# Altium project DGAS.PrjPcb
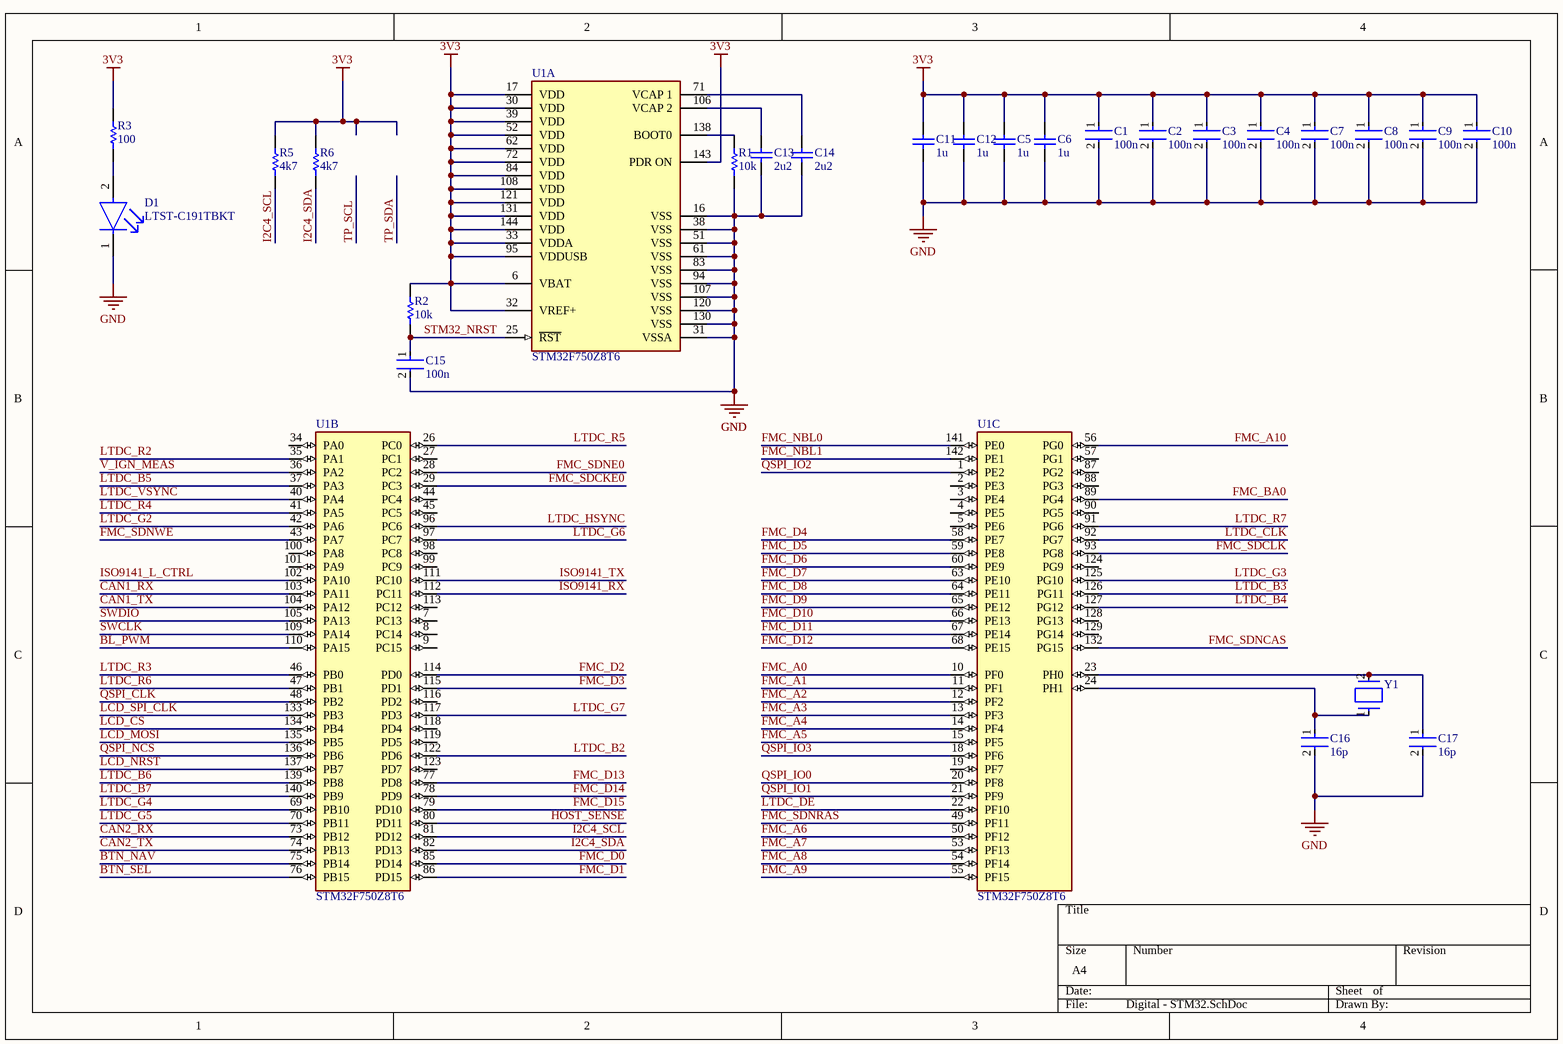
[diagram p0: Digital - STM32.SchDoc]
7 sheets, 89 parts. Net scope: global (net labels, ports and power ports of the same name join across sheets).
Board file: PCB1.PcbDoc
Sheets:
  Digital - STM32.SchDoc
  LCD.SchDoc
  DRAM and QSPI.SchDoc
  Audio.SchDoc
  OBD2.SchDoc
  Accelerometer.SchDoc
  Misc.SchDoc

## Sheet Digital - STM32.SchDoc
size A4; SheetNumber: 1; SheetTotal: 8

### Parts
C1  100n  [FP-GRM188-0_1-e0_2_0_55-IPC_A]
C2  100n  [FP-GRM188-0_1-e0_2_0_55-IPC_A]
C3  100n  [FP-GRM188-0_1-e0_2_0_55-IPC_A]
C4  100n  [FP-GRM188-0_1-e0_2_0_55-IPC_A]
C5  1u  [CAPC2013X135X45LL10T25]
C6  1u  [CAPC2013X135X45LL10T25]
C7  100n  [FP-GRM188-0_1-e0_2_0_55-IPC_A]
C8  100n  [FP-GRM188-0_1-e0_2_0_55-IPC_A]
C9  100n  [FP-GRM188-0_1-e0_2_0_55-IPC_A]
C10  100n  [FP-GRM188-0_1-e0_2_0_55-IPC_A]
C11  1u  [CAPC2013X135X45LL10T25]
C12  1u  [CAPC2013X135X45LL10T25]
C13  2u2  [CAPC2013X135X45LL10T25]
C14  2u2  [CAPC2013X135X45LL10T25]
C15  100n  [FP-GRM188-0_1-e0_2_0_55-IPC_A]
C16  16p  [FP-GRM188-0_1-e0_2_0_55-IPC_A]
C17  16p  [FP-GRM188-0_1-e0_2_0_55-IPC_A]
D1  LTST-C191TBKT  [FP-LTST-C191TBKT-MFG]
R1  10k  [RESC1608X55X30ML15T15]
R2  10k  [RESC1608X55X30ML15T15]
R3  100  [RESC1608X55X30ML15T15]
R5  4k7  [RESC1608X55X30ML15T15]
R6  4k7  [RESC1608X55X30ML15T15]
U1  STM32F750Z8T6  [FP-LQFP144-1A-MFG]  (parts A,B,C of 3)
Y1  ABM7-16.000MHZ-D2Y-T  [FP-ABM7-MFG]  (value not drawn)

### Nets
3V3: C1.1 C2.1 C3.1 C4.1 C5.2 C6.2 C7.1 C8.1 C9.1 C10.1 C11.2 C12.2 R2.2 R3.2 R5.2 R6.2 U1.6(VBAT) U1.17(VDD) U1.30(VDD) U1.32(VREF+) U1.33(VDDA) U1.39(VDD) U1.52(VDD) U1.62(VDD) U1.72(VDD) U1.84(VDD) U1.95(VDDUSB) U1.108(VDD) U1.121(VDD) U1.131(VDD) U1.143(PDR_ON) U1.144(VDD)
GND: C1.2 C2.2 C3.2 C4.2 C5.1 C6.1 C7.2 C8.2 C9.2 C10.2 C11.1 C12.1 C13.1 C14.1 C15.2 C16.2 C17.2 D1.1(C) R1.1 U1.16(VSS) U1.31(VSSA) U1.38(VSS) U1.51(VSS) U1.61(VSS) U1.83(VSS) U1.94(VSS) U1.107(VSS) U1.120(VSS) U1.130(VSS)
BL_PWM: U1.110(PA15)
BTN_NAV: U1.75(PB14)
BTN_SEL: U1.76(PB15)
CAN1_RX: U1.103(PA11)
CAN1_TX: U1.104(PA12)
CAN2_RX: U1.73(PB12)
CAN2_TX: U1.74(PB13)
FMC_A0: U1.10(PF0)
FMC_A1: U1.11(PF1)
FMC_A2: U1.12(PF2)
FMC_A3: U1.13(PF3)
FMC_A4: U1.14(PF4)
FMC_A5: U1.15(PF5)
FMC_A6: U1.50(PF12)
FMC_A7: U1.53(PF13)
FMC_A8: U1.54(PF14)
FMC_A9: U1.55(PF15)
FMC_A10: U1.56(PG0)
FMC_BA0: U1.89(PG4)
FMC_D0: U1.85(PD14)
FMC_D1: U1.86(PD15)
FMC_D2: U1.114(PD0)
FMC_D3: U1.115(PD1)
FMC_D4: U1.58(PE7)
FMC_D5: U1.59(PE8)
FMC_D6: U1.60(PE9)
FMC_D7: U1.63(PE10)
FMC_D8: U1.64(PE11)
FMC_D9: U1.65(PE12)
FMC_D10: U1.66(PE13)
FMC_D11: U1.67(PE14)
FMC_D12: U1.68(PE15)
FMC_D13: U1.77(PD8)
FMC_D14: U1.78(PD9)
FMC_D15: U1.79(PD10)
FMC_NBL0: U1.141(PE0)
FMC_NBL1: U1.142(PE1)
FMC_SDCKE0: U1.29(PC3)
FMC_SDCLK: U1.93(PG8)
FMC_SDNCAS: U1.132(PG15)
FMC_SDNE0: U1.28(PC2)
FMC_SDNRAS: U1.49(PF11)
FMC_SDNWE: U1.43(PA7)
HOST_SENSE: U1.80(PD11)
I2C4_SCL: R5.1 U1.81(PD12)
I2C4_SDA: R6.1 U1.82(PD13)
ISO9141_L_CTRL: U1.102(PA10)
ISO9141_RX: U1.112(PC11)
ISO9141_TX: U1.111(PC10)
LCD_CS: U1.134(PB4)
LCD_MOSI: U1.135(PB5)
LCD_NRST: U1.137(PB7)
LCD_SPI_CLK: U1.133(PB3)
LTDC_B2: U1.122(PD6)
LTDC_B3: U1.126(PG11)
LTDC_B4: U1.127(PG12)
LTDC_B5: U1.37(PA3)
LTDC_B6: U1.139(PB8)
LTDC_B7: U1.140(PB9)
LTDC_CLK: U1.92(PG7)
LTDC_DE: U1.22(PF10)
LTDC_G2: U1.42(PA6)
LTDC_G3: U1.125(PG10)
LTDC_G4: U1.69(PB10)
LTDC_G5: U1.70(PB11)
LTDC_G6: U1.97(PC7)
LTDC_G7: U1.117(PD3)
LTDC_HSYNC: U1.96(PC6)
LTDC_R2: U1.35(PA1)
LTDC_R3: U1.46(PB0)
LTDC_R4: U1.41(PA5)
LTDC_R5: U1.26(PC0)
LTDC_R6: U1.47(PB1)
LTDC_R7: U1.91(PG6)
LTDC_VSYNC: U1.40(PA4)
QSPI_CLK: U1.48(PB2)
QSPI_IO0: U1.20(PF8)
QSPI_IO1: U1.21(PF9)
QSPI_IO2: U1.1(PE2)
QSPI_IO3: U1.18(PF6)
QSPI_NCS: U1.136(PB6)
STM32_NRST: C15.1 R2.1 U1.25(~{RST})
SWCLK: U1.109(PA14)
SWDIO: U1.105(PA13)
V_IGN_MEAS: U1.36(PA2)
NetC13_2: C13.2 U1.106(VCAP_2)
NetC14_2: C14.2 U1.71(VCAP_1)
NetC16_1: C16.1 U1.24(PH1) Y1.1
NetC17_1: C17.1 U1.23(PH0) Y1.2
NetD1_2: D1.2(A) R3.1
NetR1_2: R1.2 U1.138(BOOT0)

Not connected (* = marked no-connect by the designer): U1 2(PE3) 3(PE4) 4(PE5) 5(PE6) 7(PC13) 8(PC14) 9(PC15) 19(PF7) 27(PC1) 34(PA0) 44(PC4) 45(PC5) 57(PG1) 87(PG2) 88(PG3) 90(PG5) 98(PC8) 99(PC9) 100(PA8) 101(PA9) 113(PC12) 116(PD2) 118(PD4) 119(PD5) 123(PD7) 124(PG9) 128(PG13) 129(PG14)

### Library data of the parts
C1-C4 C7-C10 C15-C17 = CMP-2006-02792-2: Chip Multilayer Ceramic Capacitors for General Purpose, 0603, 10uF, X5R, 15%, 20%, 6.3V; Packaging: Tape and Reel; Voltage Rating (DC): 6.3V; Width: 0.031inch; Termination: SMD/SMT; Dielectric: X5R; Package Quantity: 4000; Voltage Rating: 6.3V; Capacitance: 10uF; Case/Package: 0603; Min Operating Temperature: -55°C; Voltage: 6.3V; Length: 1.6mm; Thickness: 0.035inch; Lead Free: Lead Free; Depth: 0.8mm; Case Code (Imperial): 0603; Max Operating Temperature: 85°C; Material: Ceramic; Height: 0.8mm; Tolerance: 20%; Mount: Surface Mount; REACH SVHC: No SVHC; Radiation Hardening: No; Case Code (Metric): 1608
C5 C6 C11-C14 = CMP-1662-00015-2: Chip Capacitor, 4.7 uF, +/- 10%, 16 V, -55 to 85 degC, 0805 (2012 Metric), RoHS, Tape and Reel; PartNumber: GRM21BR61C475KA88L; Voltage Rating (DC): 16 V; Capacitance: 4.7 uF; Type (Capacitors): X5R; Case\/Package: 0805; Pins: 2; DatasheetVersion: 03/2016; REACH SVHC: No SVHC; Tolerance: 10%; Width: 1.25 mm; Mount: Surface Mount; ComponentLink1Description: Manufacturer URL; Case Code (Metric): 2012; PackageDescription: 2-Pin Surface Mount Device, Body 2 x 1.25 mm; Height: 1.25 mm; Voltage Rating: 16 V; Max Operating Temperature: 85 degC; RoHSCompliant: true; Length: 2 mm; ComponentLink1URL: http://www.murata.com/; Mounting Technology: Surface Mount; Packaging: Tape and Reel; Min Operating Temperature: -55 degC; ComponentLink2Description: Datasheet; Case Code (Imperial): 0805; Radiation Hardening: No; Package Quantity: 3000; PackageReference: 0805; ComponentLink2URL: http://search.murata.co.jp/Ceramy/image/img/A01X/G101/ENG/GRM21BR61C475KA88-01.pdf
D1 = CMP-22017-000008-1: LED BLUE CLEAR CHIP SMD; Lens Color: Colorless; Dominant Wavelength: 475nm; Forward Current: 20mA; Wavelength: 468nm; Viewing Angle: 130°; Power Dissipation: 76mW; Luminous Intensity: 180mcd; Reverse Voltage: 5V; Number of Elements: 1; Lens Style: Diffused; Forward Voltage: 3.8V; Max Power Dissipation: 75mW; Case Code (Metric): 1608; Packaging: Tape and Reel; Case/Package: 0603; Depth: 1.6mm; Mount: Surface Mount; Lead Free: Lead Free; Min Operating Temperature: -20°C; Lens Transparency: Clear; Illumination Color: Blue; Height: 0.55mm; Test Current: 20mA; Case Code (Imperial): 0603; Max Operating Temperature: 80°C; Number of Pins: 2; Length: 0.8mm; Radiation Hardening: No; Package Quantity: 1; Number of LEDs: 1; Width: 0.8mm; Color: Blue
R1-R3 R5 R6 = CMP-2000-00182-1: Part Number: ERJ-3EKF1003V; Manufacturer: Panasonic
U1 = CMP-12105-000056-1: IC MCU 32BIT 64KB FLASH 144LQFP; Manufacturer: STMicroelectronics; Number Of Cores: 1; Number Of Adc Channels: 24; Number Of Timers/Counters: 15; Number Of A/D Converters: 3; Interface: I2C,SPI,UART,USART,CAN,USB,LIN,IrDA,Ethernet,I2S,Other; Standoff Height: 0.05mm; Ram Size: 320KBytes; Max Supply Voltage: 3.6V; Number Of I2C Channels: 4; Min Supply Voltage: 1.7V; Nominal Supply Current: 12-216mA; Max Junction Temp: +105°C; Data Bus Width: 32bits; Number Of Spi Channels: 6; Core Architecture: ARM Cortex-M7; Number Of Uart Channels: 8; Memory Size: 64KBytes; Frequency: 216MHz; Number Of Pwm Channels: 33; Number Of I/Os: 114; RoHS: TRUE; Temperature Range Low: -40°C; Mouser Description: MCU 32-Bit STM32F750Z8 ARM Cortex M7 RISC 64KB Flash 1.8V/2.5V/3.3V 144-Pin LQFP Tray; Height: 1.6mm; Temperature: -40°C to +105°C; Number Of Usb Channels: 1; Package: LQFP144-1A; Ipc Land Pattern Name: QFP50P2200X2200X160-144; Number Of Ethernet Channels: 1; Automotive: No; Memory Type: FLASH; Digikey Description: IC MCU 32BIT 64KB FLASH 144LQFP; Category: IC; ComponentLink2Description: Datasheet; Device Class L1: Integrated Circuits (ICs); Ambient Temperature Range High: +85°C; Device Class L2: Embedded Processors and Controllers; Device Class L3: Microcontrollers; Temperature Range High: +105°C; Octopart: https://octopart.com/stm32f750z8t6-stmicroelectronics-94048545; Manufacturer Part Number: STM32F750Z8T6; ComponentLink2URL: https://www.st.com/resource/en/datasheet/stm32f750z8.pdf; Ambient Temperature Range Low: -40°C; Lead Free: Yes
Y1 = CMP-27762-000095-1: Crystal 16MHz ±20ppm 18pF SMD-2 6mm x 3.5mm; ESR (Equivalent Series Resistance): 50R; Frequency Stability: 30ppm; Width: 3.3mm; Frequency: 16MHz; Radiation Hardening: No; Height: 0.055inch; Tolerance: 20ppm; Length: 6mm; Case/Package: CSMD; Lead Free: Lead Free; Min Operating Temperature: -40°C; Termination: SMD/SMT; Operating Frequency: 16 MHz; Resistor Type: Ceramic; Packaging: Tape and Reel; Mount: Surface Mount; Load Capacitance: 18pF; Frequency Tolerance: 20ppm; Depth: 3.5mm; Series: ABM7; Package Quantity: 1000; Max Operating Temperature: 85°C; Number of Pins: 2

## Sheet LCD.SchDoc
size A4; SheetNumber: 2; SheetTotal: 8
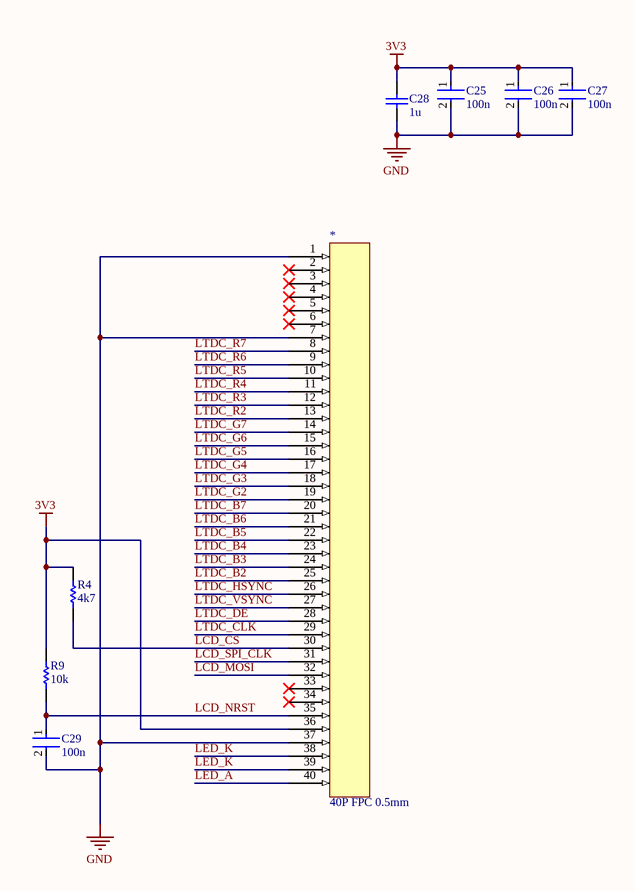
[diagram p1: LCD.SchDoc]

### Parts
*  40P FPC 0.5mm  [CONN_62684-402100ALF_AMP]
C25  100n  [FP-GRM188-0_1-e0_2_0_55-IPC_A]
C26  100n  [FP-GRM188-0_1-e0_2_0_55-IPC_A]
C27  100n  [FP-GRM188-0_1-e0_2_0_55-IPC_A]
C28  1u  [CAPC2013X135X45LL10T25]
C29  100n  [FP-GRM188-0_1-e0_2_0_55-IPC_A]
R4  4k7  [RESC1608X55X30ML15T15]
R9  10k  [RESC1608X55X30ML15T15]

### Nets
3V3: *.36 C25.1 C26.1 C27.1 C28.2 R4.2 R9.2
GND: *.1 *.7 *.37 C25.2 C26.2 C27.2 C28.1 C29.2
LCD_CS: *.30 R4.1
LCD_MOSI: *.32
LCD_NRST: *.35 C29.1 R9.1
LCD_SPI_CLK: *.31
LED_A: *.40
LED_K: *.38 *.39
LTDC_B2: *.25
LTDC_B3: *.24
LTDC_B4: *.23
LTDC_B5: *.22
LTDC_B6: *.21
LTDC_B7: *.20
LTDC_CLK: *.29
LTDC_DE: *.28
LTDC_G2: *.19
LTDC_G3: *.18
LTDC_G4: *.17
LTDC_G5: *.16
LTDC_G6: *.15
LTDC_G7: *.14
LTDC_HSYNC: *.26
LTDC_R2: *.13
LTDC_R3: *.12
LTDC_R4: *.11
LTDC_R5: *.10
LTDC_R6: *.9
LTDC_R7: *.8
LTDC_VSYNC: *.27

Not connected (* = marked no-connect by the designer): * 2* 3* 4* 5* 6* 33* 34*

### Library data of the parts
C25-C27 C29 = CMP-2006-02792-2: as C1 on sheet Digital - STM32; Packaging: Tape and Reel; Voltage Rating (DC): 6.3V; Width: 0.031inch; Termination: SMD/SMT; Dielectric: X5R; Package Quantity: 4000; Voltage Rating: 6.3V; Capacitance: 10uF; Case/Package: 0603; Min Operating Temperature: -55°C; Voltage: 6.3V; Length: 1.6mm; Thickness: 0.035inch; Lead Free: Lead Free; Depth: 0.8mm; Case Code (Imperial): 0603; Max Operating Temperature: 85°C; Material: Ceramic; Height: 0.8mm; Tolerance: 20%; Mount: Surface Mount; REACH SVHC: No SVHC; Radiation Hardening: No; Case Code (Metric): 1608
C28 = CMP-1662-00015-2: as C5 on sheet Digital - STM32; Pins: 2; DatasheetVersion: 03/2016; REACH SVHC: No SVHC; Tolerance: 10%; Width: 1.25 mm; Mount: Surface Mount; ComponentLink1Description: Manufacturer URL; Case Code (Metric): 2012; PackageDescription: 2-Pin Surface Mount Device, Body 2 x 1.25 mm; Height: 1.25 mm; Voltage Rating: 16 V; Max Operating Temperature: 85 degC; RoHSCompliant: true; Length: 2 mm; ComponentLink1URL: http://www.murata.com/; Mounting Technology: Surface Mount; Packaging: Tape and Reel; Min Operating Temperature: -55 degC; ComponentLink2Description: Datasheet; Case Code (Imperial): 0805; Radiation Hardening: No; Package Quantity: 3000; PackageReference: 0805; ComponentLink2URL: http://search.murata.co.jp/Ceramy/image/img/A01X/G101/ENG/GRM21BR61C475KA88-01.pdf
R4 R9 = CMP-2000-00182-1: as R1 on sheet Digital - STM32

## Sheet DRAM and QSPI.SchDoc
size A4; SheetNumber: 3; SheetTotal: 8
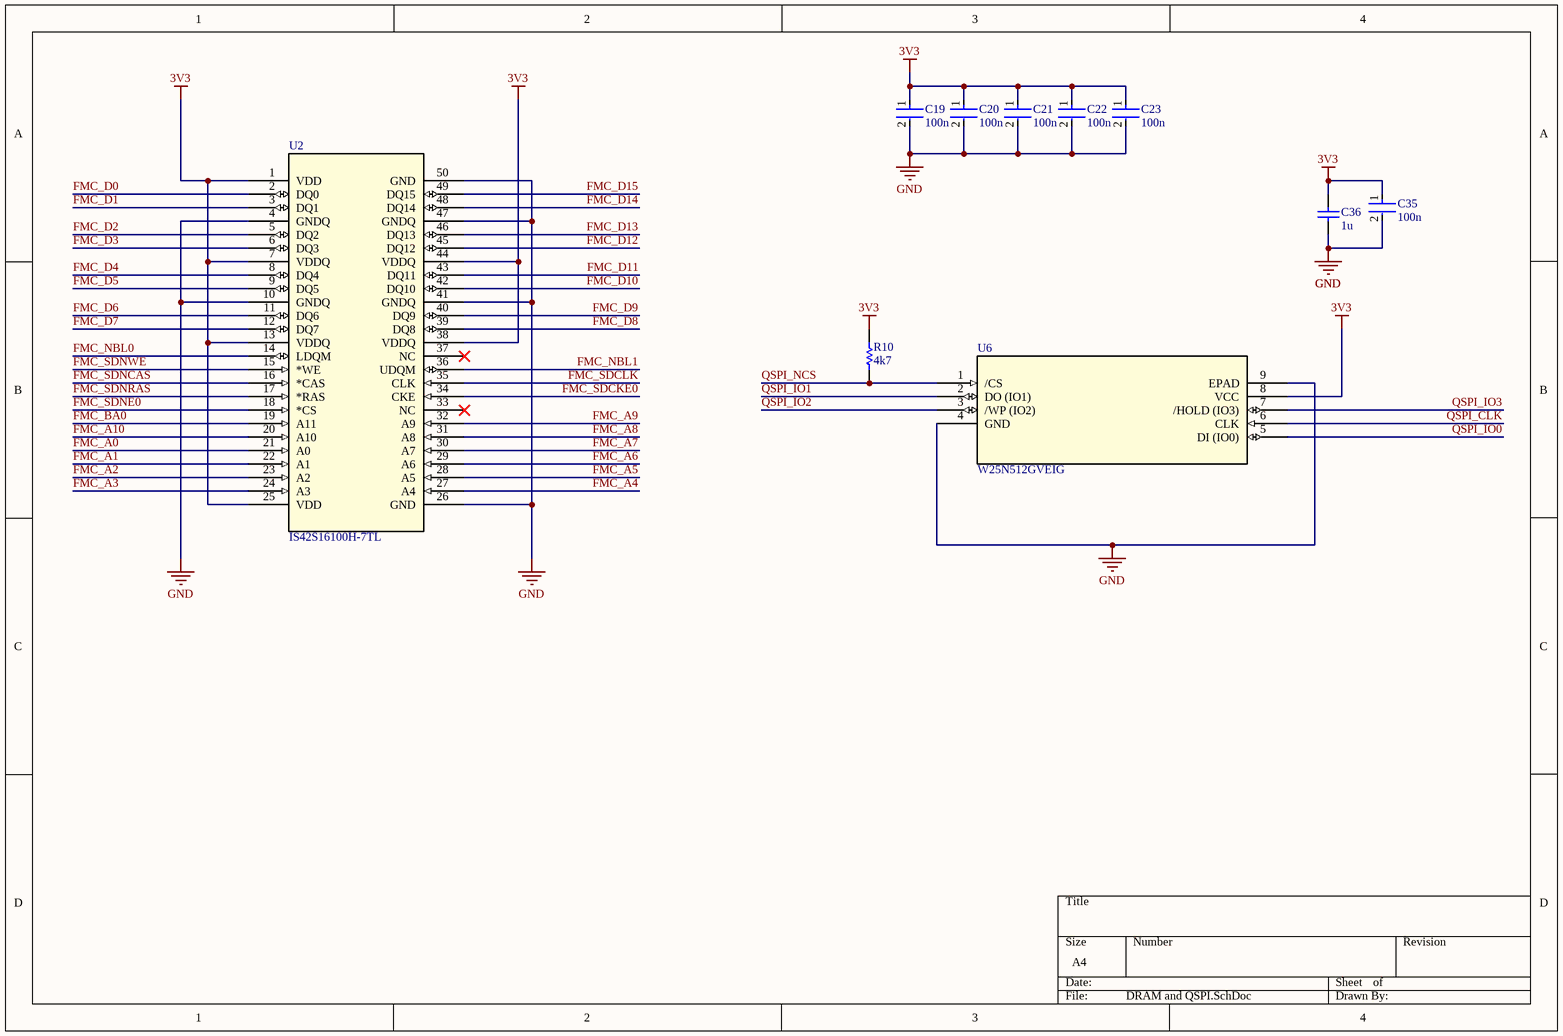
[diagram p2: DRAM and QSPI.SchDoc]

### Parts
C19  100n  [FP-GRM188-0_1-e0_2_0_55-IPC_A]
C20  100n  [FP-GRM188-0_1-e0_2_0_55-IPC_A]
C21  100n  [FP-GRM188-0_1-e0_2_0_55-IPC_A]
C22  100n  [FP-GRM188-0_1-e0_2_0_55-IPC_A]
C23  100n  [FP-GRM188-0_1-e0_2_0_55-IPC_A]
C35  100n  [FP-GRM188-0_1-e0_2_0_55-IPC_A]
C36  1u  [CAPC2013X135X45LL10T25]
R10  4k7  [RESC1608X55X30ML15T15]
U2  IS42S16100H-7TL  [TSOPII_50L_400MIL_ISI]
U6  W25N512GVEIG  [WSON8_8x6_E_WIN]

### Nets
3V3: C19.1 C20.1 C21.1 C22.1 C23.1 C35.1 C36.2 R10.2 U2.1(VDD) U2.7(VDDQ) U2.13(VDDQ) U2.25(VDD) U2.38(VDDQ) U2.44(VDDQ) U6.8(VCC)
GND: C19.2 C20.2 C21.2 C22.2 C23.2 C35.2 C36.1 U2.4(GNDQ) U2.10(GNDQ) U2.26(GND) U2.41(GNDQ) U2.47(GNDQ) U2.50(GND) U6.4(GND) U6.9(EPAD)
FMC_A0: U2.21(A0)
FMC_A1: U2.22(A1)
FMC_A2: U2.23(A2)
FMC_A3: U2.24(A3)
FMC_A4: U2.27(A4)
FMC_A5: U2.28(A5)
FMC_A6: U2.29(A6)
FMC_A7: U2.30(A7)
FMC_A8: U2.31(A8)
FMC_A9: U2.32(A9)
FMC_A10: U2.20(A10)
FMC_BA0: U2.19(A11)
FMC_D0: U2.2(DQ0)
FMC_D1: U2.3(DQ1)
FMC_D2: U2.5(DQ2)
FMC_D3: U2.6(DQ3)
FMC_D4: U2.8(DQ4)
FMC_D5: U2.9(DQ5)
FMC_D6: U2.11(DQ6)
FMC_D7: U2.12(DQ7)
FMC_D8: U2.39(DQ8)
FMC_D9: U2.40(DQ9)
FMC_D10: U2.42(DQ10)
FMC_D11: U2.43(DQ11)
FMC_D12: U2.45(DQ12)
FMC_D13: U2.46(DQ13)
FMC_D14: U2.48(DQ14)
FMC_D15: U2.49(DQ15)
FMC_NBL0: U2.14(LDQM)
FMC_NBL1: U2.36(UDQM)
FMC_SDCKE0: U2.34(CKE)
FMC_SDCLK: U2.35(CLK)
FMC_SDNCAS: U2.16(*CAS)
FMC_SDNE0: U2.18(*CS)
FMC_SDNRAS: U2.17(*RAS)
FMC_SDNWE: U2.15(*WE)
QSPI_CLK: U6.6(CLK)
QSPI_IO0: U6.5(DI_(IO0))
QSPI_IO1: U6.2(DO_(IO1))
QSPI_IO2: U6.3(/WP_(IO2))
QSPI_IO3: U6.7(/HOLD_(IO3))
QSPI_NCS: R10.1 U6.1(/CS)

Not connected (* = marked no-connect by the designer): U2 33(NC)* 37(NC)*

### Library data of the parts
C19-C23 C35 = CMP-2006-02792-2: as C1 on sheet Digital - STM32; Packaging: Tape and Reel; Voltage Rating (DC): 6.3V; Width: 0.031inch; Termination: SMD/SMT; Dielectric: X5R; Package Quantity: 4000; Voltage Rating: 6.3V; Capacitance: 10uF; Case/Package: 0603; Min Operating Temperature: -55°C; Voltage: 6.3V; Length: 1.6mm; Thickness: 0.035inch; Lead Free: Lead Free; Depth: 0.8mm; Case Code (Imperial): 0603; Max Operating Temperature: 85°C; Material: Ceramic; Height: 0.8mm; Tolerance: 20%; Mount: Surface Mount; REACH SVHC: No SVHC; Radiation Hardening: No; Case Code (Metric): 1608
C36 = CMP-1662-00015-2: as C5 on sheet Digital - STM32; Pins: 2; DatasheetVersion: 03/2016; REACH SVHC: No SVHC; Tolerance: 10%; Width: 1.25 mm; Mount: Surface Mount; ComponentLink1Description: Manufacturer URL; Case Code (Metric): 2012; PackageDescription: 2-Pin Surface Mount Device, Body 2 x 1.25 mm; Height: 1.25 mm; Voltage Rating: 16 V; Max Operating Temperature: 85 degC; RoHSCompliant: true; Length: 2 mm; ComponentLink1URL: http://www.murata.com/; Mounting Technology: Surface Mount; Packaging: Tape and Reel; Min Operating Temperature: -55 degC; ComponentLink2Description: Datasheet; Case Code (Imperial): 0805; Radiation Hardening: No; Package Quantity: 3000; PackageReference: 0805; ComponentLink2URL: http://search.murata.co.jp/Ceramy/image/img/A01X/G101/ENG/GRM21BR61C475KA88-01.pdf
R10 = CMP-2000-00182-1: as R1 on sheet Digital - STM32
U2 = IS42S16100H-7TL: No Description Available; Mfr_Name: ISSI; RefDes: RefDes; Type: Type
U6 = W25N512GVEIG: No Description Available; Mfr_Name: Winbond; Type: Memory; RefDes: RefDes

## Sheet Audio.SchDoc
size A4; SheetNumber: 5; SheetTotal: 7
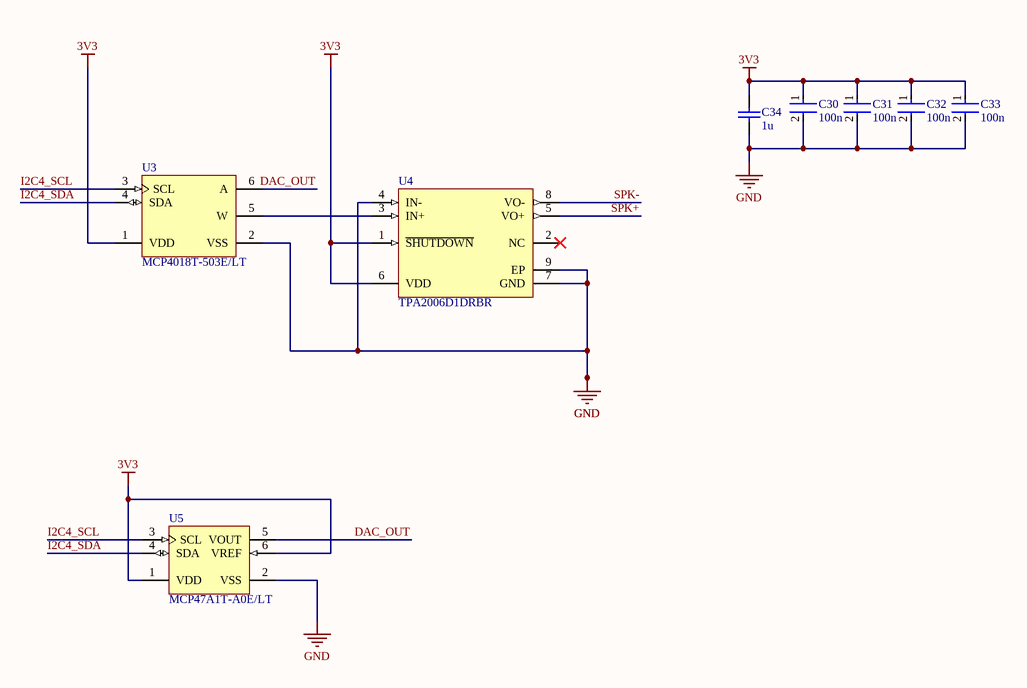
[diagram p3: Audio.SchDoc]

### Parts
C30  100n  [FP-GRM188-0_1-e0_2_0_55-IPC_A]
C31  100n  [FP-GRM188-0_1-e0_2_0_55-IPC_A]
C32  100n  [FP-GRM188-0_1-e0_2_0_55-IPC_A]
C33  100n  [FP-GRM188-0_1-e0_2_0_55-IPC_A]
C34  1u  [CAPC2013X135X45LL10T25]
U3  MCP4018T-503E/LT  [SC70-LT6_N]
U4  TPA2006D1DRBR  [DRB0008A_V]
U5  MCP47A1T-A0E/LT  [MCHP-SC70-LT6_N]

### Nets
3V3: C30.1 C31.1 C32.1 C33.1 C34.2 U3.1(VDD) U4.1(~{SHUTDOWN}) U4.6(VDD) U5.1(VDD) U5.6(VREF)
GND: C30.2 C31.2 C32.2 C33.2 C34.1 U3.2(VSS) U4.4(IN-) U4.7(GND) U4.9(EP) U5.2(VSS)
DAC_OUT: U3.6(A) U5.5(VOUT)
I2C4_SCL: U3.3(SCL) U5.3(SCL)
I2C4_SDA: U3.4(SDA) U5.4(SDA)
SPK+: U4.5(VO+)
SPK-: U4.8(VO-)
NetU3_5: U3.5(W) U4.3(IN+)

Not connected (* = marked no-connect by the designer): U4 2(NC)*

### Library data of the parts
C30-C33 = CMP-2006-02792-2: as C1 on sheet Digital - STM32; Packaging: Tape and Reel; Voltage Rating (DC): 6.3V; Width: 0.031inch; Termination: SMD/SMT; Dielectric: X5R; Package Quantity: 4000; Voltage Rating: 6.3V; Capacitance: 10uF; Case/Package: 0603; Min Operating Temperature: -55°C; Voltage: 6.3V; Length: 1.6mm; Thickness: 0.035inch; Lead Free: Lead Free; Depth: 0.8mm; Case Code (Imperial): 0603; Max Operating Temperature: 85°C; Material: Ceramic; Height: 0.8mm; Tolerance: 20%; Mount: Surface Mount; REACH SVHC: No SVHC; Radiation Hardening: No; Case Code (Metric): 1608
C34 = CMP-1662-00015-2: as C5 on sheet Digital - STM32; Pins: 2; DatasheetVersion: 03/2016; REACH SVHC: No SVHC; Tolerance: 10%; Width: 1.25 mm; Mount: Surface Mount; ComponentLink1Description: Manufacturer URL; Case Code (Metric): 2012; PackageDescription: 2-Pin Surface Mount Device, Body 2 x 1.25 mm; Height: 1.25 mm; Voltage Rating: 16 V; Max Operating Temperature: 85 degC; RoHSCompliant: true; Length: 2 mm; ComponentLink1URL: http://www.murata.com/; Mounting Technology: Surface Mount; Packaging: Tape and Reel; Min Operating Temperature: -55 degC; ComponentLink2Description: Datasheet; Case Code (Imperial): 0805; Radiation Hardening: No; Package Quantity: 3000; PackageReference: 0805; ComponentLink2URL: http://search.murata.co.jp/Ceramy/image/img/A01X/G101/ENG/GRM21BR61C475KA88-01.pdf
U3 = CMP-0188-00772-2: 7-Bit Single I2C Digital POT with Volatile Memory, 6-pin SC70, Extended Temperature, Tape and Reel; PackageReference: SC70-LT6; PackageVersion: revBB, Aug-2009; PackageDescription: 6-Lead Plastic Small Outline Transistor (LT) [SC70]; RevisionNote: URLs added.; DatasheetVersion: revA, Mar-2009; ComponentLink3Description: Package Specification; ComponentLink1Description: Manufacturer URL; ComponentLink2URL: http://ww1.microchip.com/downloads/en/DeviceDoc/22147a.pdf; ComponentLink1URL: http://www.microchip.com/; ComponentLink3URL: http://www.microchip.com/stellent/groups/techpub_sg/documents/packagingspec/en012702.pdf; ComponentLink2Description: Datasheet
U4 = CMP-0991-00129-2: 1.45-W Mono Class-D Audio Amplifier with 1.8 V Compatible Shutdown Voltage, -40 to 85 degC, 8-pin SON (DRB8), Green (RoHS & no Sb/Br); Manufacturer: Texas Instruments; Supply Min(Min)(Volt): 2.5; Supply Max(Max)(Volt): 5.5; PSRR(dB): -75; SubFamily: Dynamic Speaker; Output Power(W): 1.45; ComponentLink1Description: Manufacturer URL; ComponentLink3Description: Package Specification; Speaker Amp Type: Class-D; ComponentLink2Description: Datasheet; PartNumber: TPA2006D1DRBR; ComponentLink3URL: http://www.ti.com/litv/pdf/mpds118h; Mounting Technology: Surface Mount; PackageVersion: 4203482-2/K, 06/2012; PackageDescription: 8-Pin Plastic Small Outline, Body 3 x 3 mm, Pitch 0.65 mm; Eco-Plan: Green (RoHS & no Sb/Br); DatasheetVersion: SLOS498A; ComponentLink1URL: http://www.ti.com/; ComponentLink2URL: http://www.ti.com/general/docs/lit/getliterature.tsp?genericPartNumber=TPA2006D1&fileType=pdf; Speaker Channels: Mono; PackageReference: DRB0008A
U5 = CMP-0188-01388-1: 6-Bit Volatile DAC with Command Code, 130 µA Typical Operating Current, -40 to 125 degC, 6-pin SC70 (LT6), Tape and Reel; Manufacturer: Microchip; ComponentLink1URL: http://www.microchip.com; ComponentLink3Description: Package Specification; ComponentLink2URL: http://ww1.microchip.com/downloads/en/DeviceDoc/25154A.pdf; ComponentLink2Description: Datasheet; ComponentLink4URL: http://www.microchip.com/MCP47A1; ComponentLink1Description: Manufacturer URL; ComponentLink3URL: http://www.microchip.com/stellent/groups/techpub_sg/documents/packagingspec/en012702.pdf; PackageDescription: 6-Lead Plastic Small Outline Transistor, 2 x 1.25 mm Body, 0.65 mm Pitch; Mounting Technology: Surface Mount; PackageReference: SC70-LT6; DatasheetVersion: Rev. A; PartNumber: MCP47A1T-A0E/LT; PackageVersion: C04-151A; ComponentLink4Description: Product URL

## Sheet OBD2.SchDoc
size A4; SheetNumber: 6; SheetTotal: 8
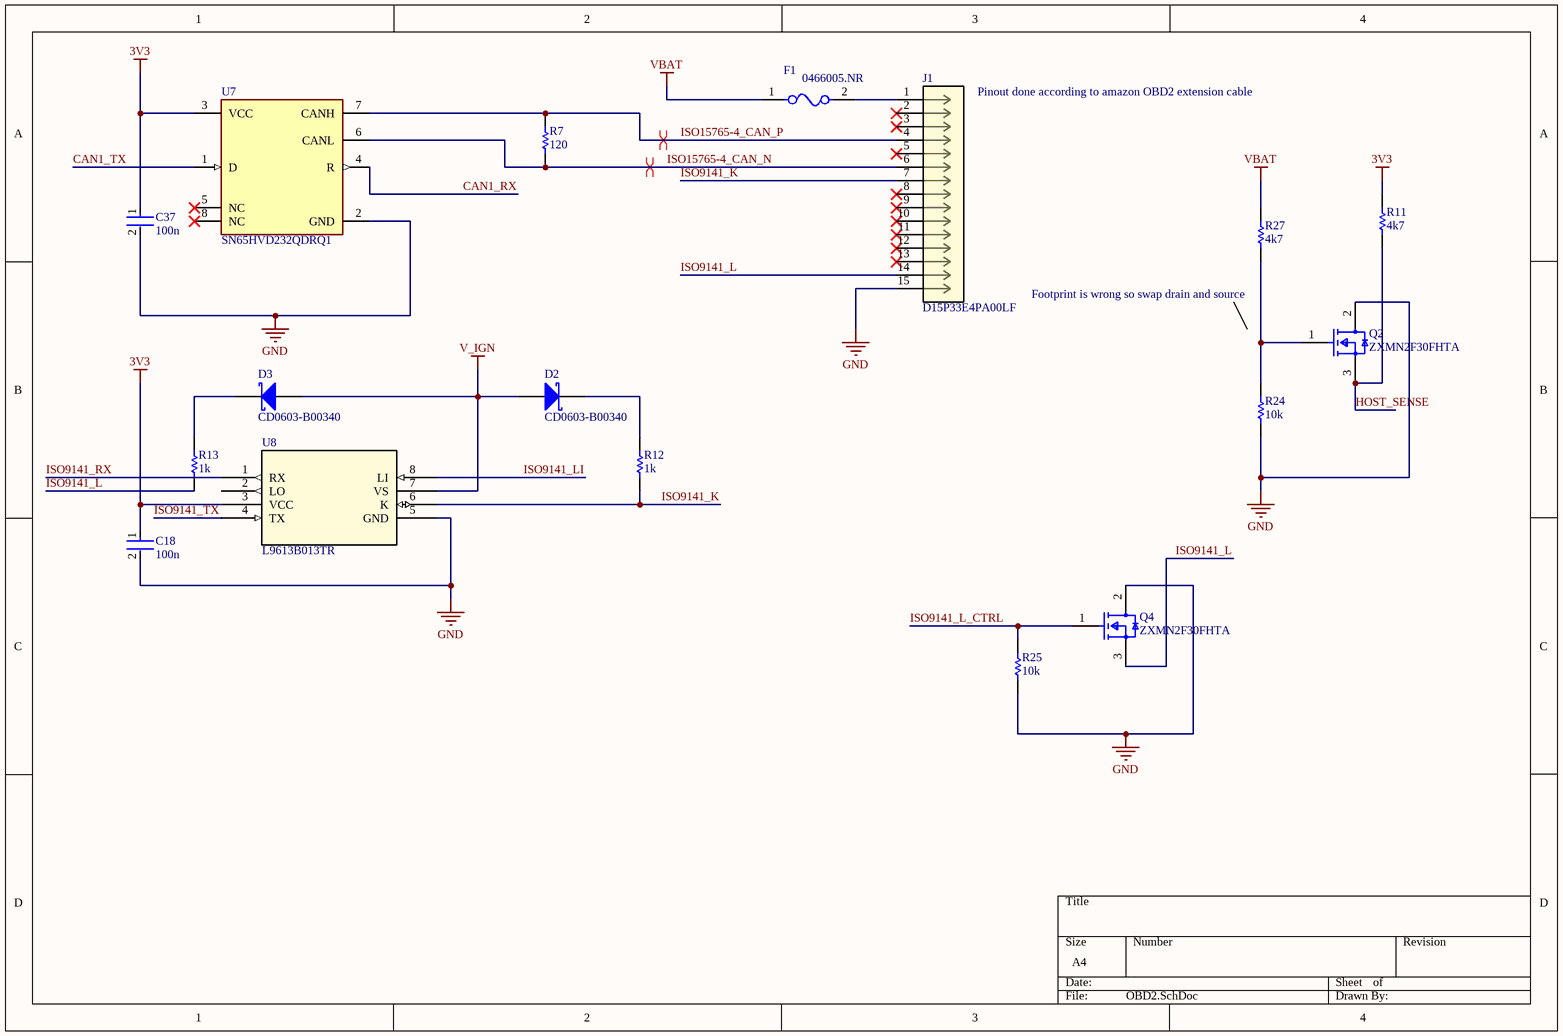
[diagram p4: OBD2.SchDoc]

### Parts
C18  100n  [FP-GRM188-0_1-e0_2_0_55-IPC_A]
C37  100n  [FP-GRM188-0_1-e0_2_0_55-IPC_A]
D2  CD0603-B00340  [BOUR-0603_V]
D3  CD0603-B00340  [BOUR-0603_V]
F1  0466005.NR  [FP-0466-MFG]
J1  D15P33E4PA00LF  [CONN9_LD15P_1556x500_AMP]
Q2  ZXMN2F30FHTA  [FP-SOT23-IPC_C]
Q4  ZXMN2F30FHTA  [FP-SOT23-IPC_C]
R7  120  [RESC1608X55X30ML15T15]
R11  4k7  [RESC1608X55X30ML15T15]
R12  1k  [RESC1608X55X30ML15T15]
R13  1k  [RESC1608X55X30ML15T15]
R24  10k  [RESC1608X55X30ML15T15]
R25  10k  [RESC1608X55X30ML15T15]
R27  4k7  [RESC1608X55X30ML15T15]
U7  SN65HVD232QDRQ1  [FP-D0008A-MFG]
U8  L9613B013TR  [L9613B013TR_STM]

### Nets
3V3: C18.1 C37.1 R11.2 U7.3(VCC) U8.3(VCC)
GND: C18.2 C37.2 J1.15 Q2.2(S) Q4.2(S) R24.1 R25.1 U7.2(GND) U8.5(GND)
V_IGN: D2.1(A) D3.1(A) U8.7(VS)
VBAT: F1.1 R27.2
CAN1_RX: U7.4(R)
CAN1_TX: U7.1(D)
HOST_SENSE: Q2.3(D) R11.1
ISO9141_K: J1.7 R12.1 U8.6(K)
ISO9141_L: J1.14 Q4.3(D) R13.1
ISO9141_L_CTRL: Q4.1(G) R25.2
ISO9141_LI: U8.8(LI)
ISO9141_RX: U8.1(RX)
ISO9141_TX: U8.4(TX)
ISO15765-4_CAN_N: J1.6 R7.1 U7.6(CANL)
ISO15765-4_CAN_P: J1.4 R7.2 U7.7(CANH)
NetD2_2: D2.2(K) R12.2
NetD3_2: D3.2(K) R13.2
NetF1_2: F1.2 J1.1
NetQ2_1: Q2.1(G) R24.2 R27.1

Not connected (* = marked no-connect by the designer): J1 2* 3* 5* 8* 9* 10* 11* 12* 13*; U7 5(NC)* 8(NC)*; U8 2(LO)

### Layout directives
differential pair: ISO15765-4_CAN_N, ISO15765-4_CAN_P

### Notes on the sheet
- Pinout done according to amazon OBD2 extension cable
- Footprint is wrong so swap drain and source

### Library data of the parts
C18 C37 = CMP-2006-02792-2: as C1 on sheet Digital - STM32; Packaging: Tape and Reel; Voltage Rating (DC): 6.3V; Width: 0.031inch; Termination: SMD/SMT; Dielectric: X5R; Package Quantity: 4000; Voltage Rating: 6.3V; Capacitance: 10uF; Case/Package: 0603; Min Operating Temperature: -55°C; Voltage: 6.3V; Length: 1.6mm; Thickness: 0.035inch; Lead Free: Lead Free; Depth: 0.8mm; Case Code (Imperial): 0603; Max Operating Temperature: 85°C; Material: Ceramic; Height: 0.8mm; Tolerance: 20%; Mount: Surface Mount; REACH SVHC: No SVHC; Radiation Hardening: No; Case Code (Metric): 1608
D2 D3 = CMP-2000-06081-1: Schottky Barrier Chip Diode Serie, 30 mA, 370 mV, -40 to 125 degC, 2-Pin SMD (0603), RoHS, Tape and Reel; Manufacturer: Bourns; COO: TW; Peak Forward Voltage: 0.37@0.001AV; Peak Non-Repetitive Surge Current: 0.5A; Pin_Count: 2; Peak Reverse Current: 1@40VuA; Peak Reverse Repetitive Voltage: 45V; Configuration: Single; Maximum Continuous Forward Current: 0.03A; Type: SmallSignalSchottkyDiode; Package Description: 2-Pin Surface Mount Device, Body 1.7 x 0.9 mm; RoHS: Yes; Dimension: 1.8(Max)x1(Max)mm; Package Reference: 0603; Mounting: SurfaceMount; Peak Reverse Recovery Time: N/A; Supplier: Bourns; HTS: 8541100070; ECCN: EAR99; Datasheet Version: 10/2009; Mounting Technology: SurfaceMount; Supplier_Package: Case0603; Packaging: TapeandReel; Family: CD0603B00340; Part No: CD0603-B00340; Manufacturer URL: http://www.bourns.com/; Datasheet URL: https://datasheet.ciiva.com/5831/714183-5831824.pdf; Operating Temperature: -40to125C
F1 = CMP-08605-000032-1: FUSE BOARD MNT 5A 32VAC/VDC 1206; Manufacturer: Littelfuse Inc; Value: 0.011Ω; Max Fuse Ac Voltage: 32V; Fuse I2T: 2.5A2Sec; Fuse Interrupt Ac Current: 50A; Fuse Blow Speed: Fast; Fuse Voltage Drop: 73.75mV; Category: Fuse; Temperature: -55°C to +90°C; Lead Free: Yes; Temperature Range High: +90°C; RoHS: TRUE; Device Class L2: Fuses; ComponentLink2URL: https://www.littelfuse.com/~/media/electronics/datasheets/fuses/littelfuse_fuse_466_datasheet.pdf.pdf; Fuse Current: 5A; Octopart: https://octopart.com/0466005.nr-littelfuse-143206; Automotive: No; Max Fuse Dc Voltage: 32V; Temperature Range Low: -55°C; Device Class L3: unset; ComponentLink2Description: Datasheet; Manufacturer Part Number: 0466005.NR; Fuse Interrupt Dc Current: 50A; Resistance: 0.011Ω; Package: 0466; Device Class L1: Circuit Protection; Mouser Description: Surface Mount Fuses 32V 5A VFA Slimline; Height: 0.66mm; Voltage Rating: 32V; Digikey Description: FUSE BOARD MNT 5A 32VAC/VDC 1206
J1 = D15P33E4PA00LF: No Description Available; Mfr_Name: Amphenol ICC; RefDes: RefDes; Type: Type
Q2 Q4 = CMP-12801-000082-1: MOSFET N-CH 20V 4.1A SOT23-3; Nominal Vgs: 900mV; Number of Elements: 1; Power Dissipation: 1.4W; On-State Resistance: 45mR; Rise Time: 5.6ns; Gate to Source Voltage (Vgs): 12V; Turn-Off Delay Time: 19.4ns; Turn-On Delay Time: 2.9ns; Max Power Dissipation: 960mW; Element Configuration: Single; Continuous Drain Current (ID): 4.9A; Input Capacitance: 452pF; Case/Package: SOT-23; Lead Free: Lead Free; Weight: 0.000282oz; Min Operating Temperature: -55°C; Mount: Surface Mount; Width: 1.4mm; Drain to Source Voltage (Vdss): 20V; Dual Supply Voltage: 20V; Length: 3.04mm; Threshold Voltage: 900mV; Package Quantity: 3000; Number of Pins: 3; Height: 1.02mm; Drain to Source Resistance: 45mR; Rds On Max: 45mR; Max Operating Temperature: 150°C; Fall Time: 5.6ns; Packaging: Tape and Reel; Termination: SMD/SMT; Drain to Source Breakdown Voltage: 20V; REACH SVHC: No SVHC; Radiation Hardening: No; Number of Channels: 1
R7 R11-R13 R24 R25 R27 = CMP-2000-00182-1: as R1 on sheet Digital - STM32
U7 = CMP-04872-000052-1: IC TRANSCEIVER HALF 1/1 8SOIC; Max Supply Current: 17mA; Data Rate: 1Mbps; Number of Receive Buffers: 1; Max Supply Voltage: 3.6V; Operating Supply Voltage: 3.3V; Interface: CAN; Min Supply Voltage: 3V; Contact Plating: Gold; Case/Package: SOIC; Mount: Surface Mount; Number of Transceivers: 1; Number of Drivers: 1; Package Quantity: 2500; Number of Pins: 8; REACH SVHC: No SVHC; RoHS Compliant: Yes; Series: -; Supply Current: 17mA; Radiation Hardening: No; Nominal Supply Current: 17mA; Lead Free: Lead Free; Number of Transmit Buffers: 1; Max Operating Temperature: 125°C; Packaging: Tape and Reel; Weight: 0.002822oz; Min Operating Temperature: -40°C
U8 = L9613B013TR: No Description Available; Mfr_Name: STMicroelectronics; RefDes: RefDes; Type: Type

## Sheet Accelerometer.SchDoc
size A4; SheetNumber: 7; SheetTotal: 7
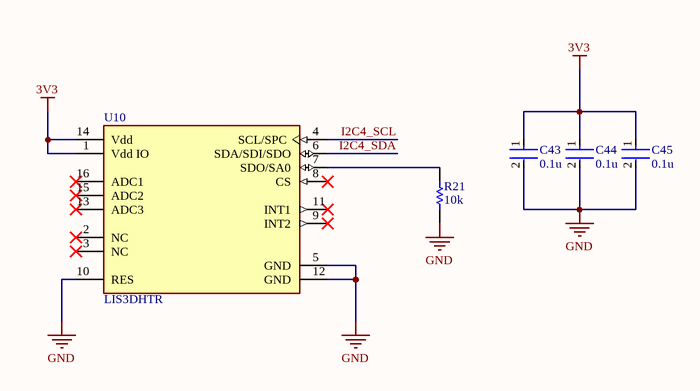
[diagram p5: Accelerometer.SchDoc]

### Parts
C43  0.1u  [FP-C0603C-CF-MFG]
C44  0.1u  [FP-C0603C-CF-MFG]
C45  0.1u  [FP-C0603C-CF-MFG]
R21  10k  [RESC1609X50X30NL8T20]
U10  LIS3DHTR  [FP-LGA-16-7983231-MFG]

### Nets
3V3: C43.1 C44.1 C45.1 U10.1(Vdd_IO) U10.14(Vdd)
GND: C43.2 C44.2 C45.2 R21.1 U10.5(GND) U10.10(RES) U10.12(GND)
I2C4_SCL: U10.4(SCL/SPC)
I2C4_SDA: U10.6(SDA/SDI/SDO)
NetR21_2: R21.2 U10.7(SDO/SA0)

Not connected (* = marked no-connect by the designer): U10 2(NC)* 3(NC)* 8(CS)* 9(INT2)* 11(INT1)* 13(ADC3)* 15(ADC2)* 16(ADC1)*

### Library data of the parts
C43-C45 = CMP-2006-03061-2: CAP CER 0.1UF 50V X7R 0603; Manufacturer: KEMET; Manufacturer Part Number: C0603C104K5RACTU; Tolerance: 0.1; Temperature Coefficient: 30ppm/°C; Material: Ceramic; Automotive Grade: Grade 1; Value: 0.10 μF; Temperature: -55°C to +125°C; RoHS: TRUE; Temperature Range High: +125°C; Lead Free: Yes; Octopart: https://octopart.com/c0603c104k5ractu-kemet-139244; Digikey Description: CAP CER 0.1UF 50V X7R 0603; Category: Cap; Package: C0603C-CF; ComponentLink2Description: Datasheet; Temperature Range Low: -55°C; Device Class L1: Passive Components; Voltage Rating: 50 V; Automotive: Yes; Device Class L3: Ceramic Capacitors; ComponentLink2URL: https://api.kemet.com/component-edge/download/datasheet/C0603C100J5GACAUTO.pdf; Capacitance: 0.10 μF; Device Class L2: Capacitors; Temperature Characteristic: X7R; Height: 0.87mm
R21 = CMP-1666-00005-4: Chip Resistor, 10 KOhm, +/- 1%, 100 mW, -55 to 155 degC, 0603 (1608 Metric), RoHS, Tape and Reel; Manufacturer: Vishay Semiconductor; Voltage Rating: 75 V; Max Operating Temperature: 155 degC; PackageDescription: 2-Pin Surface Mount Device, Body 1.575 x 0.85 mm; ComponentLink1Description: Manufacturer URL; RoHSCompliant: true; PackageReference: 0603; REACH SVHC: Unknown; Length: 1.55 mm; DatasheetVersion: 06/2012; Packaging: Tape and Reel; Min Operating Temperature: -55 degC; Mounting Technology: Surface Mount; ComponentLink2URL: https://datasheet.ciiva.com/11809/0900766b80d98afc-11809037.pdf; Height: 0.45 mm; ComponentLink2Description: Datasheet; Package Quantity: 5000; ComponentLink1URL: http://www.vishay.com/
U10 = CMP-0234-00055-6: ACCEL 2-16G I2C/SPI 16LGA; Max Supply Voltage: 3.6V; Bandwidth: 5kHz; Min Supply Voltage (DC): 1.71V; Interface: I2C; Axis: X, Y, Z; Operating Supply Voltage: 2.5V; Operating Supply Current: 11uA; Output Type: Digital; Resolution: 16b; Sensor Type: 3 Axis; Series: -; Package Quantity: 1; Case/Package: LGA; Radiation Hardening: No; Min Operating Temperature: -40°C; Length: 3mm; Max Supply Voltage (DC): 3.6V; Lead Free: Lead Free; Height: 1mm; Number of Pins: 16; RoHS Compliant: Yes; Packaging: Tape and Reel; Width: 3mm; Contact Plating: Gold; Max Operating Temperature: 85°C; Min Supply Voltage: 1.71V; REACH SVHC: No SVHC; Depth: 3mm

## Sheet Misc.SchDoc
size A4; SheetNumber: 8; SheetTotal: 8
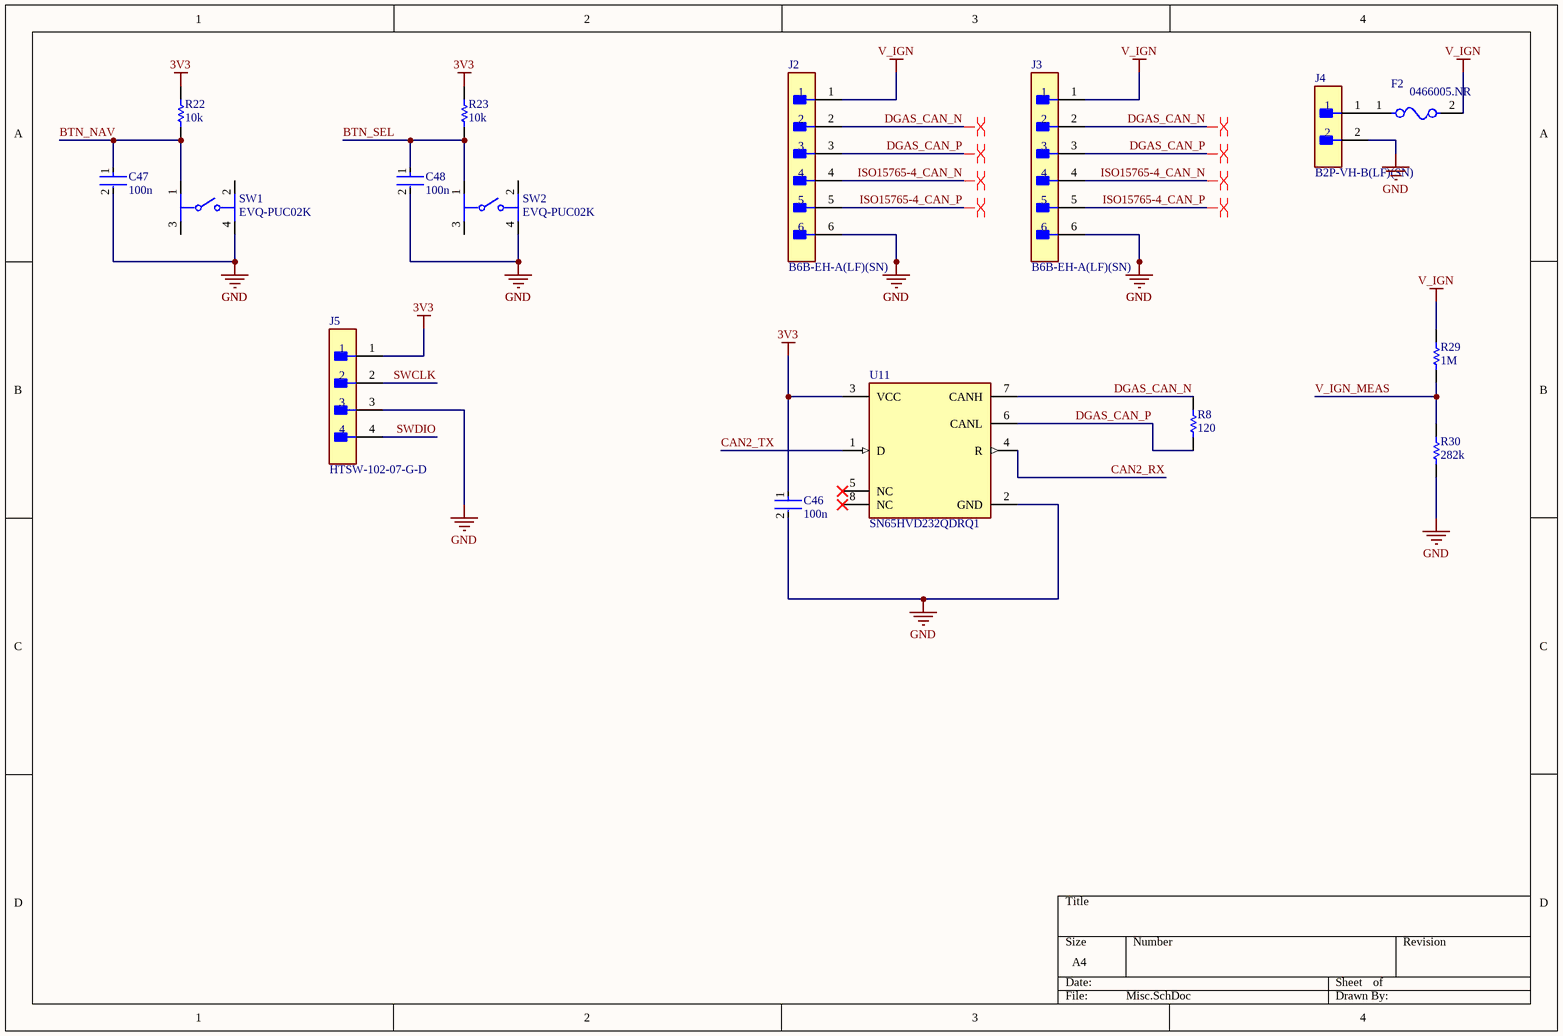
[diagram p6: Misc.SchDoc]

### Parts
C46  100n  [FP-GRM188-0_1-e0_2_0_55-IPC_A]
C47  100n  [FP-GRM188-0_1-e0_2_0_55-IPC_A]
C48  100n  [FP-GRM188-0_1-e0_2_0_55-IPC_A]
F2  0466005.NR  [FP-0466-MFG]
J2  B6B-EH-A(LF)(SN)  [FP-B6B-EH-A_LF_SN-MFG]
J3  B6B-EH-A(LF)(SN)  [FP-B6B-EH-A_LF_SN-MFG]
J4  B2P-VH-B(LF)(SN)  [FP-B2P-VH-B_LF_SN-MFG]
J5  HTSW-102-07-G-D  [FP-HTSW-102-07-G-D-MFG]
R8  120  [RESC1608X55X30ML15T15]
R22  10k  [RESC1609X50X30NL8T20]
R23  10k  [RESC1609X50X30NL8T20]
R29  1M  [RESC1609X50X30NL8T20]
R30  282k  [RESC1609X50X30NL8T20]
SW1  EVQ-PUC02K  [FP-EVQ-PUC02K-MFG]
SW2  EVQ-PUC02K  [FP-EVQ-PUC02K-MFG]
U11  SN65HVD232QDRQ1  [FP-D0008A-MFG]

### Nets
3V3: C46.1 J5.1 R22.2 R23.2 U11.3(VCC)
GND: C46.2 C47.2 C48.2 J2.6 J3.6 J4.2 J5.3 R30.1 SW1.4 SW2.4 U11.2(GND)
V_IGN: F2.2 J2.1 J3.1 R29.2
BTN_NAV: C47.1 R22.1 SW1.1
BTN_SEL: C48.1 R23.1 SW2.1
CAN2_RX: U11.4(R)
CAN2_TX: U11.1(D)
DGAS_CAN_N: J2.2 J3.2 R8.2 U11.7(CANH)
DGAS_CAN_P: J2.3 J3.3 R8.1 U11.6(CANL)
ISO15765-4_CAN_N: J2.4 J3.4
ISO15765-4_CAN_P: J2.5 J3.5
SWCLK: J5.2
SWDIO: J5.4
V_IGN_MEAS: R29.1 R30.2
NetF2_1: F2.1 J4.1

Not connected (* = marked no-connect by the designer): SW1 2 3; SW2 2 3; U11 5(NC)* 8(NC)*

### Layout directives
differential pair: DGAS_CAN_N, DGAS_CAN_P, ISO15765-4_CAN_N, ISO15765-4_CAN_P

### Library data of the parts
C46-C48 = CMP-2006-02792-2: as C1 on sheet Digital - STM32; Packaging: Tape and Reel; Voltage Rating (DC): 6.3V; Width: 0.031inch; Termination: SMD/SMT; Dielectric: X5R; Package Quantity: 4000; Voltage Rating: 6.3V; Capacitance: 10uF; Case/Package: 0603; Min Operating Temperature: -55°C; Voltage: 6.3V; Length: 1.6mm; Thickness: 0.035inch; Lead Free: Lead Free; Depth: 0.8mm; Case Code (Imperial): 0603; Max Operating Temperature: 85°C; Material: Ceramic; Height: 0.8mm; Tolerance: 20%; Mount: Surface Mount; REACH SVHC: No SVHC; Radiation Hardening: No; Case Code (Metric): 1608
F2 = CMP-08605-000032-1: as F1 on sheet OBD2; Category: Fuse; Temperature: -55°C to +90°C; Lead Free: Yes; Temperature Range High: +90°C; RoHS: TRUE; Device Class L2: Fuses; ComponentLink2URL: https://www.littelfuse.com/~/media/electronics/datasheets/fuses/littelfuse_fuse_466_datasheet.pdf.pdf; Fuse Current: 5A; Octopart: https://octopart.com/0466005.nr-littelfuse-143206; Automotive: No; Max Fuse Dc Voltage: 32V; Temperature Range Low: -55°C; Device Class L3: unset; ComponentLink2Description: Datasheet; Manufacturer Part Number: 0466005.NR; Fuse Interrupt Dc Current: 50A; Resistance: 0.011Ω; Package: 0466; Device Class L1: Circuit Protection; Mouser Description: Surface Mount Fuses 32V 5A VFA Slimline; Height: 0.66mm; Voltage Rating: 32V; Digikey Description: FUSE BOARD MNT 5A 32VAC/VDC 1206
J2 J3 = CMP-17439-000293-1: CONN HEADER VERT 6POS 2.5MM; Voltage Rating: 250V; Number of Positions: 6; Current Rating: 3A; Mated Stacking Heights: 8.1mm; Gender: Male; Insulation Material: Nylon; Number of Contacts: 6; Contact Plating: Tin; Pitch: 2.5mm; Orientation: Straight; Insulation Color: Natural; Packaging: Bulk; Termination: Solder; Flammability Rating: UL94 V-0; Lead Free: Lead Free; Contact Mating Length: 0.13inch; Color: Natural; Contact Finish - Mating: TIN; Connector Type: Header; Contact Shape: Square; Contact Type: Male Pin; Series: EH; Contact Material: Brass; Fastening Type: Friction; Number of Rows: 1; Mount: Through Hole; Housing Color: White
J4 = CMP-17439-000297-1: CONN HEADER VERT 2POS 3.96MM; Number of Positions: 2; Pitch: 0.156inch; Voltage Rating: 250V; Termination: Solder; Lead Free: Lead Free; Insulation Color: Natural; Contact Material: Brass; Flammability Rating: UL94 V-0; Packaging: Bulk; Contact Mating Length: 0.303inch; Color: Natural; Contact Shape: Square; Contact Plating: Tin; Number of Rows: 1; Insulation Material: PBT; Connector Type: Header; Contact Finish - Mating: TIN; Mount: Through Hole; Fastening Type: Friction; Contact Type: Male Pin; Series: VH
J5 = CMP-02766-000010-1: CONN HEADER VERT 4POS 2.54MM; Manufacturer: Samtec; Voltage Rating: 550V; Conn Orientation: Straight; Number Of Contacts: 4; Conn Gender: Male; Current Rating: 6.3A; Number Of Rows: 2; Category: Conn; Temperature: -55°C to +125°C; Automotive: No; Digikey Description: CONN HEADER VERT 4POS 2.54MM; ComponentLink2URL: http://suddendocs.samtec.com/catalog_english/htsw_th.pdf; Device Class L2: Headers and Wire Housings; Mouser Description: Conn Unshrouded Header HDR 4 POS 2.54mm Solder ST Thru-Hole Bag; Manufacturer Part Number: HTSW-102-07-G-D; Temperature Range High: +125°C; Contact Material: Gold,Nickel; Temperature Range Low: -55°C; ComponentLink2Description: Datasheet; Device Class L1: Connectors; Pitch: 2.54mm; Octopart: https://octopart.com/htsw-102-07-g-d-samtec-10531767; RoHS: TRUE; Package: HTSW-102-07-G-D; Lead Free: Yes; Device Class L3: unset; Height: 8.71mm
R8 = CMP-2000-00182-1: as R1 on sheet Digital - STM32
R22 R23 R29 R30 = CMP-1666-00005-4: as R21 on sheet Accelerometer; Max Operating Temperature: 155 degC; PackageDescription: 2-Pin Surface Mount Device, Body 1.575 x 0.85 mm; ComponentLink1Description: Manufacturer URL; RoHSCompliant: true; PackageReference: 0603; REACH SVHC: Unknown; Length: 1.55 mm; DatasheetVersion: 06/2012; Packaging: Tape and Reel; Min Operating Temperature: -55 degC; Mounting Technology: Surface Mount; ComponentLink2URL: https://datasheet.ciiva.com/11809/0900766b80d98afc-11809037.pdf; Height: 0.45 mm; ComponentLink2Description: Datasheet; Package Quantity: 5000; ComponentLink1URL: http://www.vishay.com/
SW1 SW2 = CMP-05618-000046-1: SWITCH TACTILE SPST-NO 0.05A 12V; Current Rating: 50mA; Operating Force: 2.2N; Actuator Color: Black; Mechanical Life: 100000Cycles; Switch Function: Off-Mom; Switch Travel: 0.3mm; Throw Configuration: SPST; Contact Resistance: 500mR; Illumination Type: Non-Illuminated; Actuator Length: 1mm; Mount: Surface Mount; Contact Plating: Silver; Series: EVQPU; Packaging: Tape and Reel; Height: 1.65mm; Radiation Hardening: No; Termination: Gull Wing; Depth: 4.5mm; Max Operating Temperature: 70°C; RoHS Compliant: Yes; Contact Current Rating: 50mA; Length: 6.4mm; Electrical Life: 100000Cycles; Max Voltage Rating (DC): 12V; Package Quantity: 1; Width: 3.5mm; Min Operating Temperature: -40°C; Max Current Rating: 50mA; Orientation: Straight; Voltage Rating (DC): 12V; Size: 3.5mm; Lead Free: Lead Free
U11 = CMP-04872-000052-1: as U7 on sheet OBD2; Contact Plating: Gold; Case/Package: SOIC; Mount: Surface Mount; Number of Transceivers: 1; Number of Drivers: 1; Package Quantity: 2500; Number of Pins: 8; REACH SVHC: No SVHC; RoHS Compliant: Yes; Series: -; Supply Current: 17mA; Radiation Hardening: No; Nominal Supply Current: 17mA; Lead Free: Lead Free; Number of Transmit Buffers: 1; Max Operating Temperature: 125°C; Packaging: Tape and Reel; Weight: 0.002822oz; Min Operating Temperature: -40°C

## Nets that join several sheets
3V3: Digital - STM32 (32 pins), LCD (7 pins), DRAM and QSPI (15 pins), Audio (10 pins), OBD2 (5 pins), Accelerometer (5 pins), Misc (5 pins)
GND: Digital - STM32 (29 pins), LCD (8 pins), DRAM and QSPI (15 pins), Audio (10 pins), OBD2 (9 pins), Accelerometer (7 pins), Misc (11 pins)
V_IGN: OBD2 (D2.1 D3.1 U8.7), Misc (F2.2 J2.1 J3.1 R29.2)
BTN_NAV: Digital - STM32 (U1.75), Misc (C47.1 R22.1 SW1.1)
BTN_SEL: Digital - STM32 (U1.76), Misc (C48.1 R23.1 SW2.1)
CAN1_RX: Digital - STM32 (U1.103), OBD2 (U7.4)
CAN1_TX: Digital - STM32 (U1.104), OBD2 (U7.1)
CAN2_RX: Digital - STM32 (U1.73), Misc (U11.4)
CAN2_TX: Digital - STM32 (U1.74), Misc (U11.1)
FMC_A0: Digital - STM32 (U1.10), DRAM and QSPI (U2.21)
FMC_A1: Digital - STM32 (U1.11), DRAM and QSPI (U2.22)
FMC_A2: Digital - STM32 (U1.12), DRAM and QSPI (U2.23)
FMC_A3: Digital - STM32 (U1.13), DRAM and QSPI (U2.24)
FMC_A4: Digital - STM32 (U1.14), DRAM and QSPI (U2.27)
FMC_A5: Digital - STM32 (U1.15), DRAM and QSPI (U2.28)
FMC_A6: Digital - STM32 (U1.50), DRAM and QSPI (U2.29)
FMC_A7: Digital - STM32 (U1.53), DRAM and QSPI (U2.30)
FMC_A8: Digital - STM32 (U1.54), DRAM and QSPI (U2.31)
FMC_A9: Digital - STM32 (U1.55), DRAM and QSPI (U2.32)
FMC_A10: Digital - STM32 (U1.56), DRAM and QSPI (U2.20)
FMC_BA0: Digital - STM32 (U1.89), DRAM and QSPI (U2.19)
FMC_D0: Digital - STM32 (U1.85), DRAM and QSPI (U2.2)
FMC_D1: Digital - STM32 (U1.86), DRAM and QSPI (U2.3)
FMC_D2: Digital - STM32 (U1.114), DRAM and QSPI (U2.5)
FMC_D3: Digital - STM32 (U1.115), DRAM and QSPI (U2.6)
FMC_D4: Digital - STM32 (U1.58), DRAM and QSPI (U2.8)
FMC_D5: Digital - STM32 (U1.59), DRAM and QSPI (U2.9)
FMC_D6: Digital - STM32 (U1.60), DRAM and QSPI (U2.11)
FMC_D7: Digital - STM32 (U1.63), DRAM and QSPI (U2.12)
FMC_D8: Digital - STM32 (U1.64), DRAM and QSPI (U2.39)
FMC_D9: Digital - STM32 (U1.65), DRAM and QSPI (U2.40)
FMC_D10: Digital - STM32 (U1.66), DRAM and QSPI (U2.42)
FMC_D11: Digital - STM32 (U1.67), DRAM and QSPI (U2.43)
FMC_D12: Digital - STM32 (U1.68), DRAM and QSPI (U2.45)
FMC_D13: Digital - STM32 (U1.77), DRAM and QSPI (U2.46)
FMC_D14: Digital - STM32 (U1.78), DRAM and QSPI (U2.48)
FMC_D15: Digital - STM32 (U1.79), DRAM and QSPI (U2.49)
FMC_NBL0: Digital - STM32 (U1.141), DRAM and QSPI (U2.14)
FMC_NBL1: Digital - STM32 (U1.142), DRAM and QSPI (U2.36)
FMC_SDCKE0: Digital - STM32 (U1.29), DRAM and QSPI (U2.34)
FMC_SDCLK: Digital - STM32 (U1.93), DRAM and QSPI (U2.35)
FMC_SDNCAS: Digital - STM32 (U1.132), DRAM and QSPI (U2.16)
FMC_SDNE0: Digital - STM32 (U1.28), DRAM and QSPI (U2.18)
FMC_SDNRAS: Digital - STM32 (U1.49), DRAM and QSPI (U2.17)
FMC_SDNWE: Digital - STM32 (U1.43), DRAM and QSPI (U2.15)
HOST_SENSE: Digital - STM32 (U1.80), OBD2 (Q2.3 R11.1)
I2C4_SCL: Digital - STM32 (R5.1 U1.81), Audio (U3.3 U5.3), Accelerometer (U10.4)
I2C4_SDA: Digital - STM32 (R6.1 U1.82), Audio (U3.4 U5.4), Accelerometer (U10.6)
ISO9141_L_CTRL: Digital - STM32 (U1.102), OBD2 (Q4.1 R25.2)
ISO9141_RX: Digital - STM32 (U1.112), OBD2 (U8.1)
ISO9141_TX: Digital - STM32 (U1.111), OBD2 (U8.4)
ISO15765-4_CAN_N: OBD2 (J1.6 R7.1 U7.6), Misc (J2.4 J3.4)
ISO15765-4_CAN_P: OBD2 (J1.4 R7.2 U7.7), Misc (J2.5 J3.5)
LCD_CS: Digital - STM32 (U1.134), LCD (*.30 R4.1)
LCD_MOSI: Digital - STM32 (U1.135), LCD (*.32)
LCD_NRST: Digital - STM32 (U1.137), LCD (*.35 C29.1 R9.1)
LCD_SPI_CLK: Digital - STM32 (U1.133), LCD (*.31)
LTDC_B2: Digital - STM32 (U1.122), LCD (*.25)
LTDC_B3: Digital - STM32 (U1.126), LCD (*.24)
LTDC_B4: Digital - STM32 (U1.127), LCD (*.23)
LTDC_B5: Digital - STM32 (U1.37), LCD (*.22)
LTDC_B6: Digital - STM32 (U1.139), LCD (*.21)
LTDC_B7: Digital - STM32 (U1.140), LCD (*.20)
LTDC_CLK: Digital - STM32 (U1.92), LCD (*.29)
LTDC_DE: Digital - STM32 (U1.22), LCD (*.28)
LTDC_G2: Digital - STM32 (U1.42), LCD (*.19)
LTDC_G3: Digital - STM32 (U1.125), LCD (*.18)
LTDC_G4: Digital - STM32 (U1.69), LCD (*.17)
LTDC_G5: Digital - STM32 (U1.70), LCD (*.16)
LTDC_G6: Digital - STM32 (U1.97), LCD (*.15)
LTDC_G7: Digital - STM32 (U1.117), LCD (*.14)
LTDC_HSYNC: Digital - STM32 (U1.96), LCD (*.26)
LTDC_R2: Digital - STM32 (U1.35), LCD (*.13)
LTDC_R3: Digital - STM32 (U1.46), LCD (*.12)
LTDC_R4: Digital - STM32 (U1.41), LCD (*.11)
LTDC_R5: Digital - STM32 (U1.26), LCD (*.10)
LTDC_R6: Digital - STM32 (U1.47), LCD (*.9)
LTDC_R7: Digital - STM32 (U1.91), LCD (*.8)
LTDC_VSYNC: Digital - STM32 (U1.40), LCD (*.27)
QSPI_CLK: Digital - STM32 (U1.48), DRAM and QSPI (U6.6)
QSPI_IO0: Digital - STM32 (U1.20), DRAM and QSPI (U6.5)
QSPI_IO1: Digital - STM32 (U1.21), DRAM and QSPI (U6.2)
QSPI_IO2: Digital - STM32 (U1.1), DRAM and QSPI (U6.3)
QSPI_IO3: Digital - STM32 (U1.18), DRAM and QSPI (U6.7)
QSPI_NCS: Digital - STM32 (U1.136), DRAM and QSPI (R10.1 U6.1)
SWCLK: Digital - STM32 (U1.109), Misc (J5.2)
SWDIO: Digital - STM32 (U1.105), Misc (J5.4)
V_IGN_MEAS: Digital - STM32 (U1.36), Misc (R29.1 R30.2)